# EAGLE design Etage0_ok_2 (EAGLE 9.2.2)
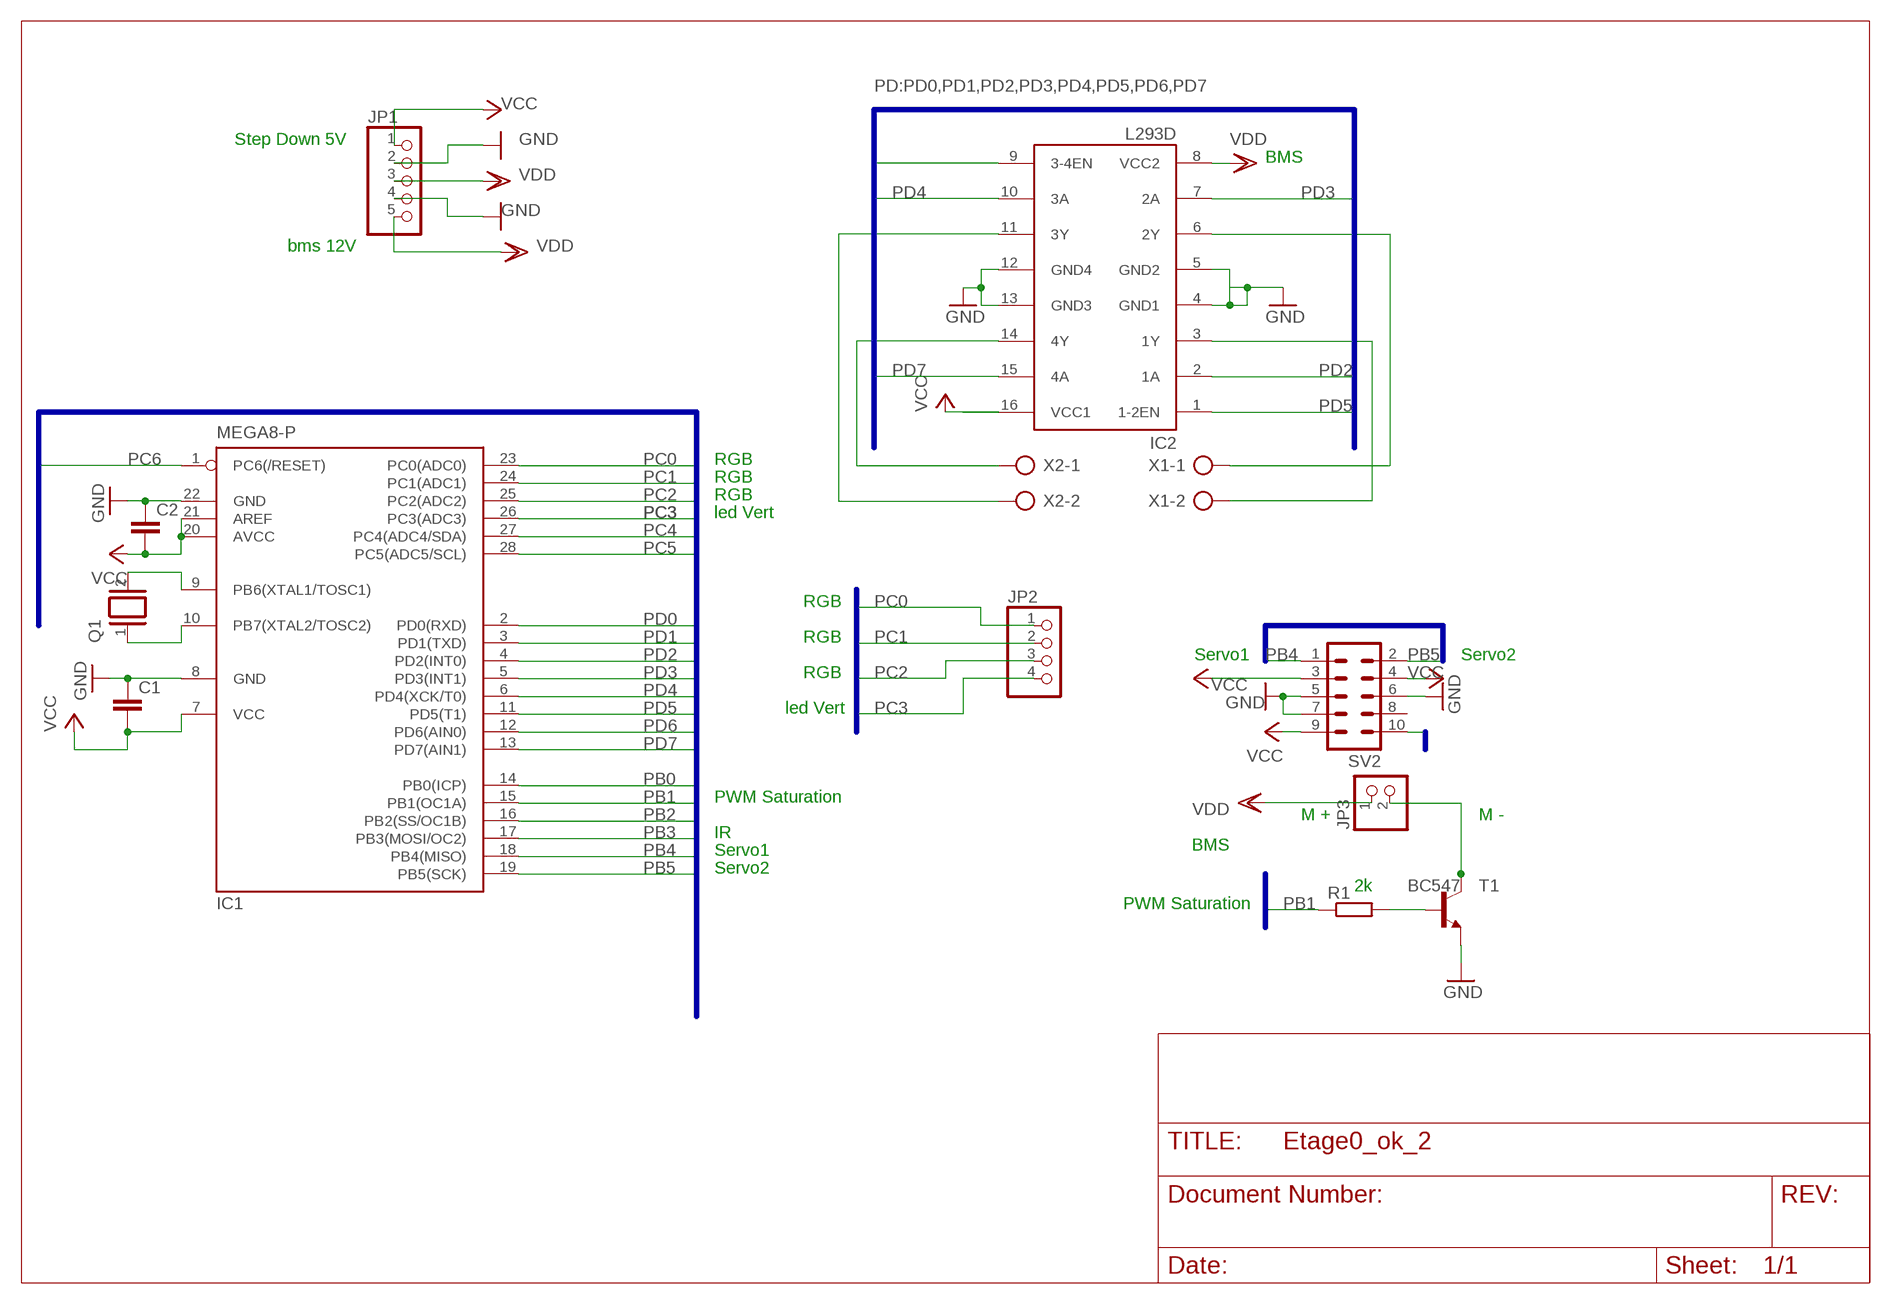
[diagram p0: schematic, sheet 1]

## Parts
C1  C-EUC1206  [C1206]
C2  C-EUC1206  [C1206]
IC1  MEGA8-P  [DIL28-3]
IC2  L293D  [DIL16]
JP1  PINHD-1X5  [1X05]
JP2  PINHD-1X4  [1X04]
JP3  PINHD-1X2  [1X02]
Q1  XTAL  [Q]
R1  R-EU_0204/7  [0204/7]
SV2  MA05-2  [MA05-2]
T1  BC547  [TO92]
X1  AK300/2  [AK300/2]
X2  AK300/2  [AK300/2]

## Nets
GND: C1.1 C2.1 IC1.8(GND) IC1.22(GND) IC2.4(GND1) IC2.5(GND2) IC2.12(GND4) IC2.13(GND3) JP1.2 JP1.4 SV2.5 SV2.6 SV2.7 T1.1(E)
N$1: IC1.9(PB6(XTAL1/TOSC1)) Q1.2
N$2: IC2.14(4Y) X2.1
N$3: IC2.11(3Y) X2.2
N$4: IC2.6(2Y) X1.1
N$5: IC2.3(1Y) X1.2
N$6: R1.2 T1.2(B)
N$7: JP3.2 T1.3(C)
N$8: IC1.10(PB7(XTAL2/TOSC2)) Q1.1
PB0: IC1.14(PB0(ICP))
PB1: IC1.15(PB1(OC1A)) R1.1
PB2: IC1.16(PB2(SS/OC1B))
PB3: IC1.17(PB3(MOSI/OC2)) SV2.10
PB4: IC1.18(PB4(MISO)) SV2.1
PB5: IC1.19(PB5(SCK)) SV2.2
PC0: IC1.23(PC0(ADC0)) JP2.1
PC1: IC1.24(PC1(ADC1)) JP2.2
PC2: IC1.25(PC2(ADC2)) JP2.3
PC3: IC1.26(PC3(ADC3)) JP2.4
PC4: IC1.27(PC4(ADC4/SDA))
PC5: IC1.28(PC5(ADC5/SCL))
PC6: IC1.1(PC6(/RESET))
PD0: IC1.2(PD0(RXD))
PD1: IC1.3(PD1(TXD))
PD2: IC1.4(PD2(INT0)) IC2.2(1A)
PD3: IC1.5(PD3(INT1)) IC2.7(2A)
PD4: IC1.6(PD4(XCK/T0)) IC2.10(3A)
PD5: IC1.11(PD5(T1)) IC2.1(1-2EN)
PD6: IC1.12(PD6(AIN0)) IC2.9(3-4EN)
PD7: IC1.13(PD7(AIN1)) IC2.15(4A)
VCC: C1.2 C2.2 IC1.7(VCC) IC1.20(AVCC) IC1.21(AREF) IC2.16(VCC1) JP1.1 SV2.3 SV2.4 SV2.9
VDD: IC2.8(VCC2) JP1.3 JP1.5 JP3.1
Unconnected: SV2.8

## Buses
PC[0..6],PD[0..7],PB[0..7]
PD:PD0,PD1,PD2,PD3,PD4,PD5,PD6,PD7
PB1
PC0,PC1,PC2,PC3
PB4,PB5
PB3

## Notes on the sheet
- Step Down 5V
- BMS
- bms 12V
- RGB
- RGB
- RGB
- led Vert
- RGB
- RGB
- Servo1 | Servo2
- RGB
- led Vert
- PWM Saturation
- M + | M -
- IR | BMS
- Servo1
- Servo2
- 2k
- PWM Saturation

## Library data of the parts
C1 C2 = rcl:C-EU: CAPACITOR, European symbol
IC1 = atmel:MEGA8-P: MICROCONTROLLER 8 Kbytes FLASH, 1 kbytes SRAM, 512 bytes EEPROM, USART, 4-channel 10 bit ADC, 2-channel 8 bit ADC Pin compatible with Atmega48, ATMega88, ATMega168 Source: avr.lbr; OC_FARNELL: unknown; OC_NEWARK: unknown
IC2 = st-microelectronics:L293D: PUSH-PULL 4 CHANNEL DRIVER; MPN: L293D; OC_FARNELL: 9589619; OC_NEWARK: 56P8249
JP1 = pinhead:PINHD-1X5: PIN HEADER
JP2 = pinhead:PINHD-1X4: PIN HEADER
JP3 = pinhead:PINHD-1X2: PIN HEADER
Q1 = special:XTAL: CRYSTAL
R1 = rcl:R-EU_: RESISTOR, European symbol; SPICEPREFIX: R
SV2 = con-lstb:MA05-2: PIN HEADER; OC_FARNELL: unknown; OC_NEWARK: unknown
T1 = transistor-neu-to92:BC547: NPN TRANSISTOR
X1 X2 = con-ptr500:AK300/2: CONNECTOR; OC_FARNELL: unknown; OC_NEWARK: unknown

## Board
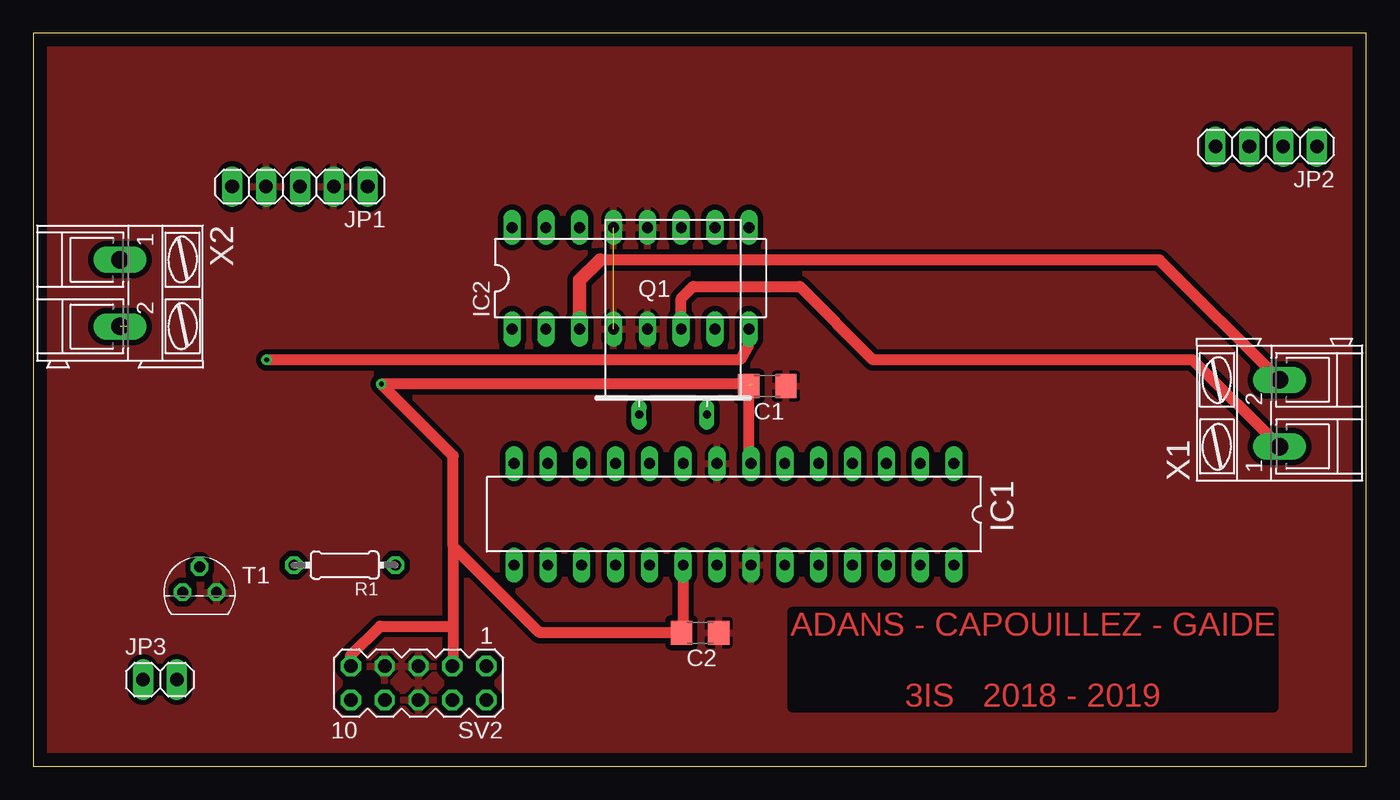
[diagram p1: board, top side]
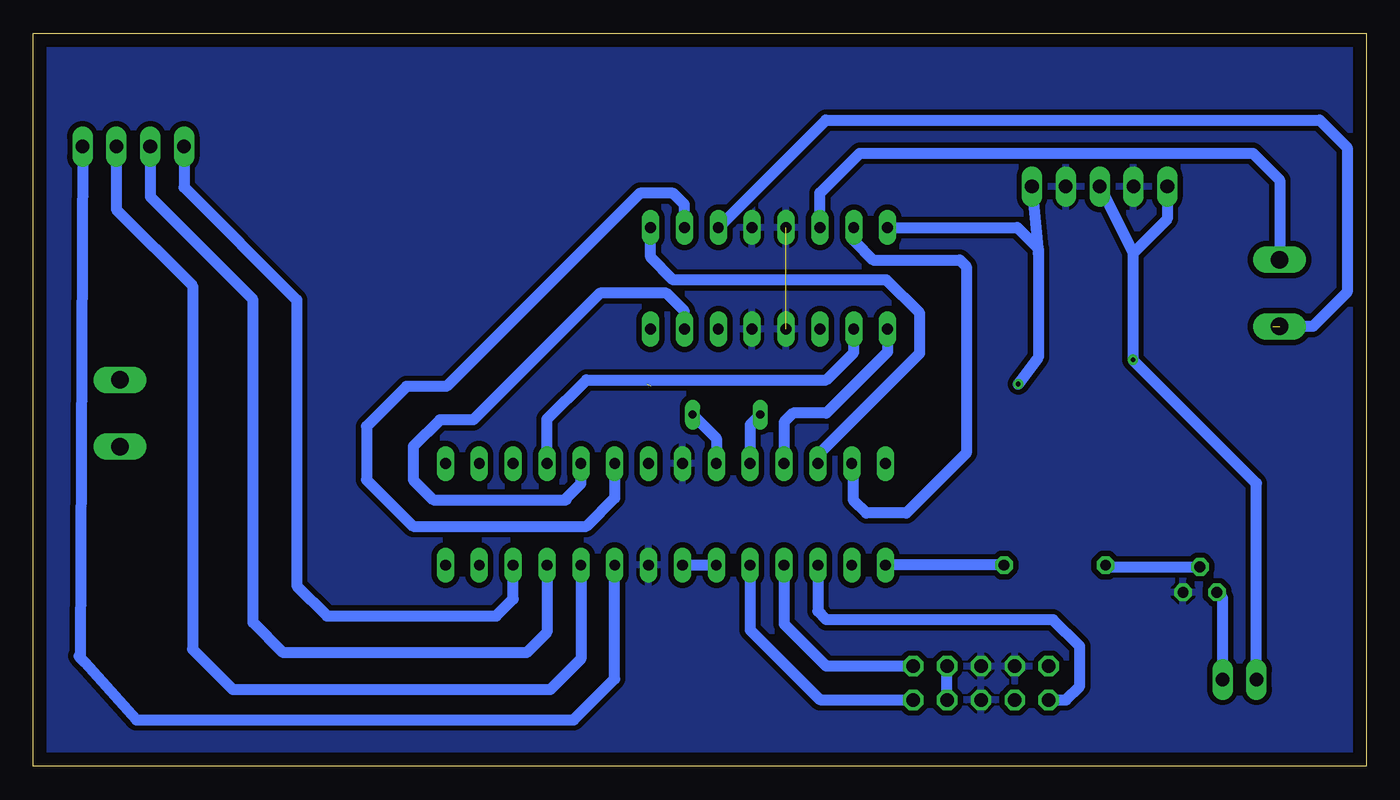
[diagram p2: board, bottom side, seen from below]

Size 100 x 55 mm. Coordinates in mm from the lower left corner, seen from the top.
Outline: 0,0 100,0 100,55 0,55 0,0
Copper layers (1*16): Top 0.035mm / dielectric 1.5mm / Bottom 0.035mm
Design rules "default": minimum track width 6mil, minimum drill 0.35mm, track to track 6mil, track to pad 6mil, pad to pad 6mil, via to via 6mil, smd to smd 6mil, copper to edge 40mil, drill to drill 6mil, minimum pad ring 10mil, minimum via ring 8mil, stop-mask expansion 4mil, vias tented up to drill 0mil, thermal gap 10mil

### Footprints (pad centres in the part's own frame; a part is rotated, then mirrored left to right if it is on the bottom)
C1206 = smd 1.6 x 1.8: 1 -1.4,0; 2 1.4,0
DIL28-3 = drill 0.813 long: 1 -16.51,-3.81; 2 -13.97,-3.81; 3 -11.43,-3.81; 4 -8.89,-3.81; 5 -6.35,-3.81; 6 -3.81,-3.81; 7 -1.27,-3.81; 8 1.27,-3.81; 9 3.81,-3.81; 10 6.35,-3.81; 11 8.89,-3.81; 12 11.43,-3.81; 13 13.97,-3.81; 14 16.51,-3.81; 15 16.51,3.81; 16 13.97,3.81; 17 11.43,3.81; 18 8.89,3.81; 19 6.35,3.81; 20 3.81,3.81; 21 1.27,3.81; 22 -1.27,3.81; 23 -3.81,3.81; 24 -6.35,3.81; 25 -8.89,3.81; 26 -11.43,3.81; 27 -13.97,3.81; 28 -16.51,3.81
DIL16 = drill 0.813 long: 1 -8.89,-3.81; 2 -6.35,-3.81; 3 -3.81,-3.81; 4 -1.27,-3.81; 5 1.27,-3.81; 6 3.81,-3.81; 7 6.35,-3.81; 8 8.89,-3.81; 9 8.89,3.81; 10 6.35,3.81; 11 3.81,3.81; 12 1.27,3.81; 13 -1.27,3.81; 14 -3.81,3.81; 15 -6.35,3.81; 16 -8.89,3.81
1X05 = drill 1.016 long: 1 -5.08,0; 2 -2.54,0; 3 0,0; 4 2.54,0; 5 5.08,0
1X04 = drill 1.016 long: 1 -3.81,0; 2 -1.27,0; 3 1.27,0; 4 3.81,0
1X02 = drill 1.016 long: 1 -1.27,0; 2 1.27,0
Q = drill 0.61 long: 1 -2.54,-7.62; 2 2.54,-7.62
0204/7 = drill 0.813 octagon: 1 -3.81,0; 2 3.81,0
MA05-2 = drill 1.016 octagon: 1 -5.08,-1.27; 2 -5.08,1.27; 3 -2.54,-1.27; 4 -2.54,1.27; 5 0,-1.27; 6 0,1.27; 7 2.54,-1.27; 8 2.54,1.27; 9 5.08,-1.27; 10 5.08,1.27
TO92 = drill 0.813 octagon: 1 1.27,0; 2 0,1.905; 3 -1.27,0
AK300/2 = drill 1.321 long: 1 -2.515,0; 2 2.489,0

### Placement (x,y rotation side)
C1  55.07,28.52 180 top
C2  50.03,10.01 180 top
IC1  52.57,18.9 180 top
IC2  44.8,36.62 0 top
JP1  20,43.5 180 top
JP2  92.5,46.5 180 top
JP3  9.5,6.5 0 top
Q1  48,34 0 top
R1  23.36,15.09 180 top
SV2  28.9,6.24 180 top
T1  12.47,13.05 0 top
X1  93.5,26.5 90 top
X2  6.5,35.5 270 top

### Tracks (layer width: path | path; a pad name or v marks a point on that pad's centre or on a via)
GND  (1 unrouted)
  pour Bottom (isolate 0.406): -0.77,63.8 102.1,63.8 101.6,-1.27 -1.27,-1.27
  pour Top (isolate 0.406): 101,59 101,-1.5 -2,-1.5 -2,59
N$1
  Bottom 0.813: Q1.2 48.76,24.6 IC1.9
N$2
  Bottom 0.813: IC2.14 40.99,43.01 38,46 8.5,46 6.5,44 X2.1
N$3  (1 unrouted)
  Bottom 0.813: IC2.11 40.54,48.5 3.5,48.5 1.42,46.42 1.42,35.58 4,33 7,33
N$4
  Top 0.813: IC2.6 48.61,35.11 49.5,36 57.5,36 63,30.5 86.98,30.5 X1.1
N$5
  Top 0.813: X1.2 84.49,38 42.5,38
  Top 1.016: IC2.3 40.99,36.49 42.5,38
N$6
  Bottom 0.508: R1.2 19.5,15.04
  Bottom 0.813: R1.2 19.41,14.96 T1.2
N$7
  Bottom 0.508: T1.3 11.05,13.05 10.94,12.94 10.88,12.9
  Bottom 0.813: JP3.2 10.77,12.62 T1.3
N$8
  Bottom 0.813: Q1.1 46.22,25.62 IC1.10
PB1
  Bottom 0.813: R1.1 IC1.15
PB3
  Bottom 0.813: SV2.10 22.53,4.97 21.5,6 21.5,9 23.5,11 40.5,11 41.14,11.64 IC1.17
PB4
  Bottom 0.813: SV2.1 40.51,7.51 43.68,10.68 IC1.18
PB5
  Bottom 0.508: 34.01,5 SV2.2
  Bottom 0.813: IC1.19 46.22,10.22 41,5 34.01,5
PC0
  Bottom 0.813: 96.59,8.28 96.16,7.8 | 96.16,7.8 92.28,3.47 59.46,3.47 56.38,6.55 IC1.23 | JP2.1 96.5,8.14 96.16,7.8
PC1
  Bottom 0.813: IC1.24 58.92,8.05 61.23,5.74 85.01,5.74 88.05,8.78 88.05,36.06 93.77,41.78 JP2.2
PC2
  Bottom 0.813: IC1.25 61.46,10.05 63,8.51 81.24,8.51 83.51,10.78 83.51,35.01 91.23,42.73 JP2.3
PC3
  Bottom 0.813: IC1.26 64,12.55 65.27,11.28 77.97,11.28 80.24,13.55 80.24,35 88.69,43.45 JP2.4
PD2
  Bottom 0.813: IC2.2 38.45,31.05 40.5,29 58.5,29 61.46,26.04 IC1.4
PD3
  Bottom 0.508: 60,20 60,20.13
  Bottom 0.813: IC2.7 51.15,34.15 52.5,35.5 57.5,35.5 67,26 69.5,26 71.5,24 71.5,21.5 70,20 60,20 | 60,20.13 58.92,21.21 IC1.5
PD4
  Bottom 0.813: IC1.6 56.38,20.12 58.5,18 71.5,18 75,21.5 75,25.5 72,28.5 69,28.5 54.5,43 52,43 51.15,42.15 IC2.10
PD5
  Bottom 0.813: IC2.1 35.91,31.09 40.5,26.5 43,26.5 43.68,25.82 IC1.11
PD6
  Bottom 0.813: IC1.12 41.14,23.36 33.5,31 33.5,34 36,36.5 52,36.5 53.69,38.19 IC2.9
PD7
  Bottom 0.813: IC2.15 38.45,39.45 37,38 30.5,38 30,37.5 30,23.5 34.5,19 37.5,19 38.5,20 38.5,22.61 IC1.13
VCC  (via drill 0.35)  (1 unrouted)
  Top 0.508: 48.76,10.14 C2.2 | 53.84,26.35 C1.2
  Top 0.813: IC1.20 48.76,10.14 | 53.97,28.68 v26.1,28.68 31.5,23.28 31.5,16.5 | C2.2 37.99,10.01 31.5,16.5 | 31.5,16.5 31.5,10.5 | SV2.9 23.82,8.32 26,10.5 31.5,10.5 | 31.5,10.5 31.5,7.57 SV2.3 | C1.2 53.67,22.88 IC1.7
  Bottom 0.813: IC1.21 IC1.20 | SV2.4 SV2.3 | 24.6,38.48 24.6,30.68 v26.1,28.68 | IC2.16 26.17,40.43 24.6,38.86 24.6,38.48 | JP1.1 24.6,38.48
VDD  (via drill 0.35)
  Top 0.813: IC2.8 53.69,31.69 53,30.5 v17.5,30.5
  Bottom 0.813: JP1.3 17.46,38.52 | 17.46,38.52 17.5,38.62 v17.5,30.5 8.23,21.23 JP3.1 | JP1.5 14.92,41.06 17.46,38.52

### Text on the board
Top: ADANS - CAPOUILLEZ - GAIDE / / 3IS 2018 - 2019